# Altium schematic sheet STSPIN220 Stepper Motor Driver.SchDoc: Stepper Motor Driver
size A4
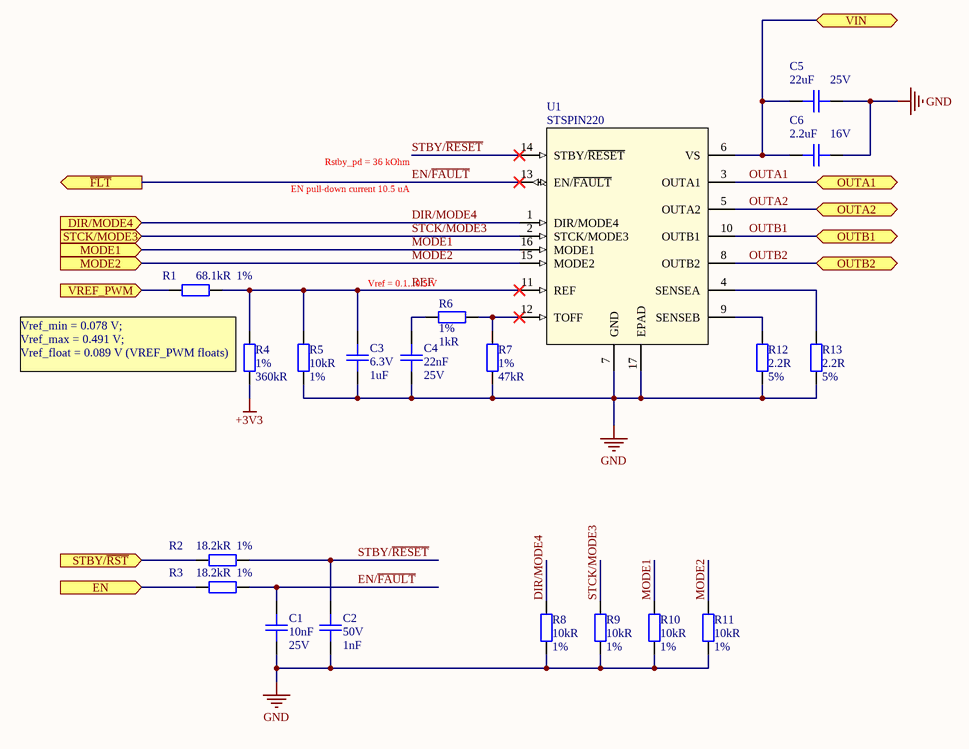
[diagram p0: STSPIN220 Stepper Motor Driver.SchDoc]

## Parts
C1  Capacitance: 10nF  Voltage: 25V  [C0402]  (hidden comment: CAP CER 10nF 25V X7R 10% 0402)
C2  Voltage Rating (DC): 50V  Capacitance: 1nF  [C0402]  (hidden comment: CAP CER 1000PF 50V X7R 0402)
C3  Voltage Rating: 6.3V  Capacitance: 1uF  [C0402]  (hidden comment: CAP CER 1UF 6.3V X5R 0402)
C4  Capacitance: 22nF  Voltage Rating: 25V  [C0402]  (hidden comment: CAP CER 0.022UF 25V X7R 0402)
C5  Capacitance: 22uF  Voltage Rating: 25V  [C0805]  (hidden comment: CAP CER 22UF 25V X5R 0805)
C6  Voltage Rating: 16V  Capacitance: 2.2uF  [C0603]  (hidden comment: CAP CER 2.2UF 16V X5R 0603)
R1  Resistance: 68.1kR  Tolerance: 1%  [R0402]  (hidden comment: RES SMD 68.1K OHM 1% 1/16W 0402)
R2  Resistance: 18.2kR  Tolerance: 1%  [R0402]  (hidden comment: RES SMD 18.2K OHM 1% 1/16W 0402)
R3  Resistance: 18.2kR  Tolerance: 1%  [R0402]  (hidden comment: RES SMD 18.2K OHM 1% 1/16W 0402)
R4  Tolerance: 1%  Resistance: 360kR  [R0402]  (hidden comment: RES SMD 360KOHM 1% 1/16W 0402)
R5  Resistance: 10kR  Tolerance: 1%  [R0402]  (hidden comment: RES SMD 10K OHM 1% 1/16W 0402)
R6  Tolerance: 1%  Resistance: 1kR  [R0402]  (hidden comment: RES SMD 1K OHM 1% 1/16W 0402)
R7  Tolerance: 1%  Resistance: 47kR  [R0402]  (hidden comment: RES SMD 47K OHM 1% 1/16W 0402)
R8  Resistance: 10kR  Tolerance: 1%  [R0402]  (hidden comment: RES SMD 10K OHM 1% 1/16W 0402)
R9  Resistance: 10kR  Tolerance: 1%  [R0402]  (hidden comment: RES SMD 10K OHM 1% 1/16W 0402)
R10  Resistance: 10kR  Tolerance: 1%  [R0402]  (hidden comment: RES SMD 10K OHM 1% 1/16W 0402)
R11  Resistance: 10kR  Tolerance: 1%  [R0402]  (hidden comment: RES SMD 10K OHM 1% 1/16W 0402)
R12  Resistance: 2.2R  Tolerance: 5%  [R2512]  (hidden comment: RES SMD 2.2 OHM 5% 1W 2512)
R13  Resistance: 2.2R  Tolerance: 5%  [R2512]  (hidden comment: RES SMD 2.2 OHM 5% 1W 2512)
U1  STSPIN220  [VFQFPN-16_STM]

## Ports
DIR/MODE4 (in), EN (in), MODE1 (in), MODE2 (in), OUTA1, OUTA2, OUTB1, OUTB2, STBY/~{RST} (in), STCK/MODE3 (in), VIN, VREF_PWM (in), ~{FLT} (out)

## Nets
+3V3: R4.2
GND: C1.1 C2.1 C3.1 C4.1 C5.2 C6.2 R5.1 R7.1 R8.1 R9.1 R10.1 R11.1 R12.1 R13.1 U1.7(GND) U1.17(EPAD)
DIR/MODE4: R8.2 U1.1(DIR/MODE4) ; port DIR/MODE4
EN: R3.2 ; port EN
EN/~{FAULT}: C1.2 R3.1 U1.13(EN/~{FAULT}) ; port ~{FLT}
MODE1: R10.2 U1.16(MODE1) ; port MODE1
MODE2: R11.2 U1.15(MODE2) ; port MODE2
OUTA1: U1.3(OUTA1) ; port OUTA1
OUTA2: U1.5(OUTA2) ; port OUTA2
OUTB1: U1.10(OUTB1) ; port OUTB1
OUTB2: U1.8(OUTB2) ; port OUTB2
REF: C3.2 R1.1 R4.1 R5.2 U1.11(REF)
STBY/~{RESET}: C2.2 R2.1 U1.14(STBY/~{RESET})
STBY/~{RST}: R2.2 ; port STBY/~{RST}
STCK/MODE3: R9.2 U1.2(STCK/MODE3) ; port STCK/MODE3
VIN: C5.1 C6.1 U1.6(VS) ; port VIN
VREF_PWM: R1.2 ; port VREF_PWM
NetC4_2: C4.2 R6.1
NetR6_2: R6.2 R7.2 U1.12(TOFF)
NetR12_2: R12.2 U1.9(SENSEB)
NetR13_2: R13.2 U1.4(SENSEA)

## Notes on the sheet
- (near U1) Rstby_pd = 36 kOhm
- (near U1) EN pull-down current 10.5 uA
- Vref = 0.1...0.5 V
- (near R4) Vref_min = 0.078 V;
  Vref_max = 0.491 V;
  Vref_float = 0.089 V (VREF_PWM floats)
- Title
- Size:
- Date:
- A4
- Number:
- Time:
- Revision:
- Sheet
- of
- File:

## Library data of the parts
C1 = CAP CER 10nF 25V X7R 10% 0402: Manufacturer: Kyocera AVX; Manufacturer Part Number: 04023C103KAT2A; Dissipation Factor: 12.5%; Insulation Resistance: 100GR; Supplier 1: Digi-Key; Stock 1: 1015537; Pricing 1: 1=0.1, 10=0.034, 50=0.0182, 100=0.0149, 500=0.0107, 1000=0.0084, 2500=0.0076, 5000=0.007 (USD); Mount: Surface Mount; Case/Package: 0402; Case Code (Metric): 1005; Case Code (Imperial): 0402; Min Operating Temperature: -55°C; Max Operating Temperature: 125°C; Tolerance: 10%; Dielectric: X7R; Voltage Rating (DC): 25V; Packaging: Tape and Reel; Voltage Rating: 25V; Package Quantity: 1; Termination: SMD/SMT; Length: 1mm; Height: 0.56mm; Depth: 0.5mm; Width: 0.02inch; Thickness: 0.022inch; Radiation Hardening: No; REACH SVHC: No SVHC; Lead Free: Lead Free; ComponentLink1URL: http://www.farnell.com/datasheets/2237835.pdf?src-supplier=Element14; ComponentLink1Description: http://www.farnell.com/datasheets/2237835.pdf?src-supplier=Element14; ComponentLink2URL: http://catalogs.avx.com/SurfaceMount.pdf?src-supplier=Digi-Key; ComponentLink2Description: http://catalogs.avx.com/SurfaceMount.pdf?src-supplier=Digi-Key; ComponentLink3URL: http://www.alliedelec.com/m/d/a24bb5190bea413b2ff164816f55e87c.pdf?src-supplier=Allied+Electronics; ComponentLink3Description: http://www.alliedelec.com/m/d/a24bb5190bea413b2ff164816f55e87c.pdf?src-supplier=Allied+Electronics; ComponentLink4URL: http://uk.rs-online.com/webdocs/13ec/0900766b813ece35.pdf?src-supplier=RSComponents; ComponentLink4Description: http://uk.rs-online.com/webdocs/13ec/0900766b813ece35.pdf?src-supplier=RSComponents; Supplier Part Number 1: 478-1113-1-ND
C2 = CAP CER 1000PF 50V X7R 0402: 1000pF ±10% 50V Ceramic Capacitor X7R 0402 (1005 Metric); Manufacturer: TDK-Lambda; Manufacturer Part Number: C0402C102K5RACTU; Supplier 1: Digi-Key; Stock 1: 1578852; Pricing 1: 1=0.1, 10=0.021, 50=0.0116, 100=0.0095, 500=0.0068, 1000=0.0053, 2500=0.0048, 5000=0.0045 (USD); Case/Package: 0402; Number of Pins: 2; Dielectric Material: Ceramic; Dielectric: X7R; Packaging: Cut Tape; Tolerance: 10%; Length: 1mm; Height: 500um; Width: 500um; REACH SVHC: No SVHC; ComponentLink1URL: http://www.onlinecomponents.com/productFiles/mf-KEM/kem_c1002_x7r_smd.pdf?src-supplier=Onlinecomponents.com; ComponentLink1Description: http://www.onlinecomponents.com/productFiles/mf-KEM/kem_c1002_x7r_smd.pdf?src-supplier=Onlinecomponents.com; Supplier Part Number 1: 399-1032-6-ND; Mount: Surface Mount
C3 = CAP CER 1UF 6.3V X5R 0402: 1µF ±10% 6.3V Ceramic Capacitor X5R 0402 (1005 Metric); Manufacturer: Yageo; Manufacturer Part Number: CC0402KRX5R5BB105; Supplier 1: Digi-Key; Stock 1: 34926286; Pricing 1: 1=0.1, 10=0.05, 50=0.0272, 100=0.0222, 500=0.0158, 1000=0.0124, 2500=0.0113, 5000=0.0104 (USD); Mount: Surface Mount; Case/Package: 0402; Number of Pins: 2; Case Code (Imperial): 0402; Case Code (Metric): 1005; Dielectric Material: Ceramic; Min Operating Temperature: -55°C; Max Operating Temperature: 85°C; Tolerance: 10%; Packaging: Tape and Reel; Dielectric: X5R; Voltage Rating (DC): 6.3V; Package Quantity: 1; Termination: SMD/SMT; Length: 1mm; Height: 0.5mm; Width: 0.02inch; Thickness: 0.022inch; Depth: 0.5mm; Radiation Hardening: No; Lead Free: Lead Free; REACH SVHC: No SVHC; ComponentLink1URL: http://www.farnell.com/datasheets/70765.pdf?src-supplier=Farnell; ComponentLink1Description: http://www.farnell.com/datasheets/70765.pdf?src-supplier=Farnell; ComponentLink2URL: http://www.yageo.com/documents/recent/UPY-GPHC_X5R_4V-to-50V_25.pdf?src-supplier=Digi-Key; ComponentLink2Description: http://www.yageo.com/documents/recent/UPY-GPHC_X5R_4V-to-50V_25.pdf?src-supplier=Digi-Key; Supplier Part Number 1: 311-1438-1-ND; Composition: Ceramic; Halogen Free: Halogen Free; ComponentLink3URL: http://www.farnell.com/datasheets/2167237.pdf?src-supplier=Element14; ComponentLink3Description: http://www.farnell.com/datasheets/2167237.pdf?src-supplier=Element14; ComponentLink4URL: http://www.yageo.com/documents/recent/UPY-GPHC_X5R_4V-to-50V_12.pdf?src-supplier=Avnet+Europe; ComponentLink4Description: http://www.yageo.com/documents/recent/UPY-GPHC_X5R_4V-to-50V_12.pdf?src-supplier=Avnet+Europe; ComponentLink5URL: http://www.farnell.com/datasheets/1359354.pdf?src-supplier=Element14; ComponentLink5Description: http://www.farnell.com/datasheets/1359354.pdf?src-supplier=Element14; ComponentLink6URL: http://www.farnell.com/datasheets/70765.pdf?src-supplier=Element14; ComponentLink6Description: http://www.farnell.com/datasheets/70765.pdf?src-supplier=Element14; ComponentLink7URL: http://www.yageo.com/documents/recent/UPY-GPHC_X5R_4V-to-50V_12.pdf?src-supplier=Avnet; ComponentLink7Description: http://www.yageo.com/documents/recent/UPY-GPHC_X5R_4V-to-50V_12.pdf?src-supplier=Avnet
C4 = CAP CER 0.022UF 25V X7R 0402: 0.022µF ±10% 25V Ceramic Capacitor X7R 0402 (1005 Metric); Manufacturer: TDK; Manufacturer Part Number: CGA2B2X7R1E223K050BA; Supplier 1: Digi-Key; Stock 1: 330320; Pricing 1: 1=0.1, 10=0.057, 50=0.0312, 100=0.0255, 500=0.0182, 1000=0.0143, 2500=0.013, 5000=0.012 (USD); Mount: Surface Mount; Case/Package: 0402; Weight: 2.3E-05oz; Case Code (Imperial): 0402; Case Code (Metric): 1005; Min Operating Temperature: -55°C; Max Operating Temperature: 125°C; Voltage Rating (DC): 25V; Tolerance: 10%; Packaging: Tape and Reel; Package Quantity: 1; Dielectric: X7R; Termination: SMD/SMT; Composition: Ceramic; Length: 1mm; Height: 0.5mm; Width: 0.5mm; Thickness: 0.022inch; Depth: 0.5mm; Ratings: AEC-Q200; REACH SVHC: No SVHC; ComponentLink1URL: http://www.mouser.com/ds/2/400/lcc_automotive_general_en-843974.pdf?src-supplier=Mouser; ComponentLink1Description: http://www.mouser.com/ds/2/400/lcc_automotive_general_en-843974.pdf?src-supplier=Mouser; Supplier Part Number 1: 445-5609-1-ND
C5 = CAP CER 22UF 25V X5R 0805: 22µF ±20% 25V Ceramic Capacitor X5R 0805 (2012 Metric); Manufacturer: Yageo; Manufacturer Part Number: CC0805MKX5R8BB226; Supplier 1: Digi-Key; Stock 1: 1060; Pricing 1: 1=0.5, 10=0.353, 50=0.267, 100=0.2325, 500=0.1722, 1000=0.1464 (USD); Mount: Surface Mount; Case/Package: 0805; Weight: 0.000194oz; Case Code (Metric): 2012; Case Code (Imperial): 0805; Min Operating Temperature: -55°C; Max Operating Temperature: 85°C; Packaging: Tape and Reel; Tolerance: 20%; Dielectric: X5R; Termination: SMD/SMT; Voltage Rating (DC): 25V; Package Quantity: 3000; Length: 0.079inch; Height: 1.25mm; Width: 0.049inch; Thickness: 0.057inch; Lead Free: Lead Free; Halogen Free: Halogen Free; ComponentLink1URL: http://www.yageo.com/documents/recent/UPY-GPHC_X5R_4V-to-50V_25.pdf?src-supplier=Digi-Key; ComponentLink1Description: http://www.yageo.com/documents/recent/UPY-GPHC_X5R_4V-to-50V_25.pdf?src-supplier=Digi-Key; ComponentLink2URL: http://www.mouser.com/ds/2/447/Yageo_UPY-GP_NP0_16V-to-50V_9-358835.pdf?src-supplier=Mouser; ComponentLink2Description: http://www.mouser.com/ds/2/447/Yageo_UPY-GP_NP0_16V-to-50V_9-358835.pdf?src-supplier=Mouser; Supplier Part Number 1: 311-1903-1-ND
C6 = CAP CER 2.2UF 16V X5R 0603: 2.2µF ±10% 16V Ceramic Capacitor X5R 0603 (1608 Metric); Manufacturer: Yageo; Manufacturer Part Number: CC0603KRX5R7BB225; Supplier 1: Digi-Key; Stock 1: 126369; Pricing 1: 1=0.19, 10=0.132, 100=0.0667, 500=0.0456, 1000=0.0404 (USD); Mount: Surface Mount; Case/Package: 0603; Case Code (Imperial): 0603; Case Code (Metric): 1608; Min Operating Temperature: -55°C; Max Operating Temperature: 85°C; Tolerance: 10%; Packaging: Tape and Reel; Dielectric: X5R; Voltage Rating (DC): 16V; Termination: SMD/SMT; Length: 1.6mm; Height: 0.8mm; Width: 0.031inch; Thickness: 0.035inch; Depth: 0.8mm; Radiation Hardening: No; Lead Free: Lead Free; REACH SVHC: Unknown; ComponentLink1URL: http://www.farnell.com/datasheets/2167237.pdf?src-supplier=Element14; ComponentLink1Description: http://www.farnell.com/datasheets/2167237.pdf?src-supplier=Element14; Supplier Part Number 1: 311-1784-1-ND; Composition: Ceramic; Halogen Free: Halogen Free
R1 = RES SMD 68.1K OHM 1% 1/16W 0402: 68.1 kOhms ±1% 0.063W, 1/16W Chip Resistor 0402 (1005 Metric) Moisture Resistant Thick Film; Manufacturer: Yageo; Manufacturer Part Number: RC0402FR-0768K1L; Power Rating: 62.5mW; Voltage Rating: 50V; Temperature Coefficient: 100ppm/°C; Max Power Dissipation: 63mW; Supplier 1: Digi-Key; Stock 1: 140424; Pricing 1: 1=0.1, 10=0.016, 100=0.0064, 1000=0.0029, 2500=0.0025, 5000=0.0021 (USD); Case/Package: 0402; Weight: 2.3E-05oz; Case Code (Imperial): 0402; Case Code (Metric): 1005; Min Operating Temperature: -55°C; Max Operating Temperature: 155°C; Packaging: Tape and Reel; Composition: Thick Film; Number of Terminations: 2; Termination: SMD/SMT; Military Standard: Not; Voltage Rating (DC): 50V; Working Voltage: 50V; Features: Moisture Resistant; Length: 1mm; Height: 0.016inch; Width: 0.02inch; Depth: 0.5mm; Lead Free: Lead Free; ComponentLink1URL: http://www.mouser.com/ds/2/447/PYu-RC0402_51_RoHS_L_6_r-8721.pdf?src-supplier=Mouser; ComponentLink1Description: http://www.mouser.com/ds/2/447/PYu-RC0402_51_RoHS_L_6_r-8721.pdf?src-supplier=Mouser; ComponentLink2URL: http://www.yageo.com/documents/recent/PYu-RC0402_51_RoHS_L_6_r.pdf?src-supplier=Future+Electronics; ComponentLink2Description: http://www.yageo.com/documents/recent/PYu-RC0402_51_RoHS_L_6_r.pdf?src-supplier=Future+Electronics; ComponentLink3URL: https://www.verical.com/server-webapp/html/getDatasheet?partID=325048&src-supplier=Verical; ComponentLink3Description: https://www.verical.com/server-webapp/html/getDatasheet?partID=325048&src-supplier=Verical; Supplier Part Number 1: YAG3213CT-ND; Mount: Surface Mount
R2 R3 = RES SMD 18.2K OHM 1% 1/16W 0402: 18.2 kOhms ±1% 0.063W, 1/16W Chip Resistor 0402 (1005 Metric) Moisture Resistant Thick Film; Manufacturer: Yageo; Manufacturer Part Number: RC0402FR-0718K2L; Power Rating: 62.5mW; Voltage Rating: 50V; Temperature Coefficient: 100ppm/°C; Max Power Dissipation: 63mW; Supplier 1: Digi-Key; Stock 1: 372233; Pricing 1: 1=0.1, 10=0.015, 100=0.0062, 1000=0.0028, 2500=0.0024, 5000=0.002 (USD); Case/Package: 0402; Case Code (Metric): 1005; Case Code (Imperial): 0402; Contact Plating: Tin,Lead,Matte; Min Operating Temperature: -55°C; Max Operating Temperature: 155°C; Packaging: Tape and Reel; Package Quantity: 10000; Composition: Thick Film; Number of Terminations: 2; Termination: SMD/SMT; Military Standard: Not; Voltage Rating (DC): 50V; Working Voltage: 50V; Features: Moisture Resistant; Length: 1mm; Height: 0.016inch; Width: 0.02inch; Depth: 0.5mm; Radiation Hardening: No; Lead Free: Lead Free; ComponentLink1URL: http://www.yageo.com/documents/recent/PYu-RC0402_51_RoHS_L_6_r.pdf?src-supplier=Future+Electronics; ComponentLink1Description: http://www.yageo.com/documents/recent/PYu-RC0402_51_RoHS_L_6_r.pdf?src-supplier=Future+Electronics; ComponentLink2URL: http://www.yageo.com.tw/exep/pages/download/literatures/PYu-R_INT-thick_7.pdf?src-supplier=Digi-Key; ComponentLink2Description: http://www.yageo.com.tw/exep/pages/download/literatures/PYu-R_INT-thick_7.pdf?src-supplier=Digi-Key; ComponentLink3URL: http://www.mouser.com/ds/2/447/PYu-RC0402_51_RoHS_L_6_r-8721.pdf?src-supplier=Mouser; ComponentLink3Description: http://www.mouser.com/ds/2/447/PYu-RC0402_51_RoHS_L_6_r-8721.pdf?src-supplier=Mouser; ComponentLink4URL: http://www.yageo.com/documents/recent/PYu-RC0402_51_RoHS_L_6.pdf?src-supplier=Avnet+Europe; ComponentLink4Description: http://www.yageo.com/documents/recent/PYu-RC0402_51_RoHS_L_6.pdf?src-supplier=Avnet+Europe; Supplier Part Number 1: YAG2371CT-ND; Mount: Surface Mount
R4 = RES SMD 360KOHM 1% 1/16W 0402: 360 kOhms ±1% 0.063W, 1/16W Chip Resistor 0402 (1005 Metric) Moisture Resistant Thick Film; Manufacturer: Yageo; Manufacturer Part Number: RC0402FR-07360KL; Power Rating: 62.5mW; Voltage Rating: 50V; Temperature Coefficient: 100ppm/°C; Max Power Dissipation: 63mW; Supplier 1: Digi-Key; Stock 1: 472644; Pricing 1: 1=0.1, 10=0.016, 100=0.0064, 1000=0.0029, 2500=0.0025, 5000=0.0021 (USD); Case/Package: 0402; Case Code (Metric): 1005; Case Code (Imperial): 0402; Contact Plating: Tin,Matte; Min Operating Temperature: -55°C; Max Operating Temperature: 155°C; Packaging: Tape and Reel; Composition: Thick Film; Number of Terminations: 2; Termination: SMD/SMT; Military Standard: Not; Voltage Rating (DC): 50V; Package Quantity: 1; Features: Moisture Resistant; Length: 1mm; Height: 0.016inch; Width: 0.02inch; Depth: 0.5mm; REACH SVHC: Unknown; Lead Free: Lead Free; ComponentLink1URL: http://www.yageo.com/documents/recent/PYu-RC_Group_51_RoHS_L_10.pdf?src-supplier=Digi-Key; ComponentLink1Description: http://www.yageo.com/documents/recent/PYu-RC_Group_51_RoHS_L_10.pdf?src-supplier=Digi-Key; ComponentLink2URL: http://www.yageo.com/documents/recent/PYu-RC0402_51_RoHS_L_6_r.pdf?src-supplier=Future+Electronics; ComponentLink2Description: http://www.yageo.com/documents/recent/PYu-RC0402_51_RoHS_L_6_r.pdf?src-supplier=Future+Electronics; ComponentLink3URL: http://www.yageo.com/documents/recent/PYu-RC0402_51_RoHS_L_6.pdf?src-supplier=Avnet; ComponentLink3Description: http://www.yageo.com/documents/recent/PYu-RC0402_51_RoHS_L_6.pdf?src-supplier=Avnet; ComponentLink4URL: http://www.mouser.com/ds/2/447/PYu-RC0402_51_RoHS_L_6_r-8721.pdf?src-supplier=Mouser; ComponentLink4Description: http://www.mouser.com/ds/2/447/PYu-RC0402_51_RoHS_L_6_r-8721.pdf?src-supplier=Mouser; Supplier Part Number 1: 311-360KLRCT-ND; Mount: Surface Mount
R5 R8-R11 = RES SMD 10K OHM 1% 1/16W 0402: 10 kOhms ±1% 0.063W, 1/16W Chip Resistor 0402 (1005 Metric) Moisture Resistant Thick Film; Manufacturer: Yageo; Manufacturer Part Number: RC0402FR-0710KP; Temperature Coefficient: 150ppm/°C; Max Power Dissipation: 63mW; Supplier 1: Digi-Key; Stock 1: 839368; Pricing 1: 1=0.1, 10=0.035, 100=0.014, 1000=0.0063, 2500=0.0055, 5000=0.0045 (USD); Case/Package: 0402; Case Code (Metric): 1005; Case Code (Imperial): 0402; Min Operating Temperature: -55°C; Max Operating Temperature: 155°C; Packaging: Tape and Reel; Composition: Thick Film; Number of Terminations: 2; Features: Moisture Resistant; Length: 0.039inch; Height: 0.016inch; Width: 0.02inch; ComponentLink1URL: http://www.yageo.com/NewPortal/yageodocoutput?fileName=/pdf/R-Chip/PYu-RC_51_RoHS_P_0.pdf&src-supplier=Digi-Key; ComponentLink1Description: http://www.yageo.com/NewPortal/yageodocoutput?fileName=/pdf/R-Chip/PYu-RC_51_RoHS_P_0.pdf&src-supplier=Digi-Key; Supplier Part Number 1: YAG1249CT-ND; Mount: Surface Mount
R6 = RES SMD 1K OHM 1% 1/16W 0402: 1 kOhms ±1% 0.063W, 1/16W Chip Resistor 0402 (1005 Metric) Moisture Resistant Thick Film; Manufacturer: Yageo; Manufacturer Part Number: RC0402FR-071KL; Temperature Coefficient: 100ppm/°C; Power Rating: 62.5mW; Voltage Rating: 50V; Supplier 1: Digi-Key; Stock 1: 9574509; Pricing 1: 1=0.1, 10=0.015, 100=0.0062, 1000=0.0028, 2500=0.0024, 5000=0.002 (USD); Case/Package: 0402; Number of Pins: 2; Case Code (Imperial): 0402; Case Code (Metric): 1005; Min Operating Temperature: -55°C; Max Operating Temperature: 155°C; Packaging: Tape and Reel; Composition: Thick Film; Voltage Rating (DC): 50V; Termination: SMD/SMT; Military Standard: Not; Length: 1mm; Height: 0.32mm; Width: 0.5mm; Depth: 0.5mm; REACH SVHC: Unknown; Lead Free: Lead Free; ComponentLink1URL: http://www.mouser.com/ds/2/447/PYu-RC0402_51_RoHS_L_6_r-8721.pdf?src-supplier=Mouser; ComponentLink1Description: http://www.mouser.com/ds/2/447/PYu-RC0402_51_RoHS_L_6_r-8721.pdf?src-supplier=Mouser; ComponentLink2URL: http://documents.rs-components.com/techlib://itc_doclist_GB.htm?stockno=6186122&src-supplier=RSComponents; ComponentLink2Description: http://documents.rs-components.com/techlib://itc_doclist_GB.htm?stockno=6186122&src-supplier=RSComponents; ComponentLink3URL: http://www.farnell.com/datasheets/1018594.pdf?src-supplier=Element14; ComponentLink3Description: http://www.farnell.com/datasheets/1018594.pdf?src-supplier=Element14; ComponentLink4URL: http://www.yageo.com/documents/recent/PYu-RC0402_51_RoHS_L_6_r.pdf?src-supplier=Future+Electronics; ComponentLink4Description: http://www.yageo.com/documents/recent/PYu-RC0402_51_RoHS_L_6_r.pdf?src-supplier=Future+Electronics; ComponentLink5URL: http://www.farnell.com/datasheets/2167052.pdf?src-supplier=Element14; ComponentLink5Description: http://www.farnell.com/datasheets/2167052.pdf?src-supplier=Element14; Supplier Part Number 1: 311-1.00KLRCT-ND; Mount: Surface Mount
R7 = RES SMD 47K OHM 1% 1/16W 0402: 47 kOhms ±1% 0.063W, 1/16W Chip Resistor 0402 (1005 Metric) Moisture Resistant Thick Film; Manufacturer: Yageo; Manufacturer Part Number: RC0402FR-0747KL; Power Rating: 62.5mW; Voltage Rating: 50V; Temperature Coefficient: 100ppm/°C; Max Power Dissipation: 63mW; Supplier 1: Digi-Key; Stock 1: 0; Pricing 1: 1=0.1, 10=0.015, 100=0.0062, 1000=0.0028, 2500=0.0024, 5000=0.002 (USD); Case/Package: 0402; Case Code (Imperial): 0402; Case Code (Metric): 1005; Min Operating Temperature: -55°C; Max Operating Temperature: 155°C; Packaging: Tape and Reel; Package Quantity: 1; Termination: SMD/SMT; Composition: Thick Film; Number of Terminations: 2; Military Standard: Not; Features: Moisture Resistant; Length: 1mm; Height: 0.016inch; Width: 0.5mm; Depth: 0.5mm; REACH SVHC: Unknown; Lead Free: Lead Free; ComponentLink1URL: http://www.yageo.com/documents/recent/PYu-RC0402_51_RoHS_L_6_r.pdf?src-supplier=Future+Electronics; ComponentLink1Description: http://www.yageo.com/documents/recent/PYu-RC0402_51_RoHS_L_6_r.pdf?src-supplier=Future+Electronics; ComponentLink2URL: http://www.farnell.com/datasheets/1018594.pdf?src-supplier=Element14; ComponentLink2Description: http://www.farnell.com/datasheets/1018594.pdf?src-supplier=Element14; ComponentLink3URL: https://www.verical.com/server-webapp/html/getDatasheet?partID=323748&src-supplier=Verical; ComponentLink3Description: https://www.verical.com/server-webapp/html/getDatasheet?partID=323748&src-supplier=Verical; ComponentLink4URL: http://www.yageo.com/documents/recent/PYu-RC_Group_51_RoHS_L_10.pdf?src-supplier=Digi-Key; ComponentLink4Description: http://www.yageo.com/documents/recent/PYu-RC_Group_51_RoHS_L_10.pdf?src-supplier=Digi-Key; Supplier Part Number 1: 311-47.0KLRCT-ND; Mount: Surface Mount
R12 R13 = RES SMD 2.2 OHM 5% 1W 2512: 2.2 Ohms ±5% 1W Chip Resistor 2512 (6432 Metric) Automotive AEC-Q200 Thick Film; Manufacturer: Vishay Dale; Manufacturer Part Number: CRCW25122R20JNEG; Temperature Coefficient: 200ppm/°C; Voltage Rating: 500V; Supplier 1: Digi-Key; Stock 1: 19521; Pricing 1: 1=0.34, 10=0.292, 100=0.114, 1000=0.0477 (USD); Case/Package: 2512; Number of Pins: 2; Case Code (Metric): 6432; Case Code (Imperial): 2512; Contact Plating: Tin; Min Operating Temperature: -55°C; Max Operating Temperature: 155°C; Package Quantity: 2000; Power Rating: 1W; Packaging: Tape and Reel; Composition: Thick Film; Number of Terminations: 2; Termination: SMD/SMT; Military Standard: Not; Max Power Dissipation: 1W; Features: Automotive AEC-Q200; Length: 6.3mm; Height: 0.6mm; Width: 3.15mm; Depth: 3.15mm; Radiation Hardening: No; REACH SVHC: Unknown; Lead Free: Lead Free; ComponentLink1URL: http://www.vishay.com/docs/20035/dcrcwe3.pdf?src-supplier=Digi-Key; ComponentLink1Description: http://www.vishay.com/docs/20035/dcrcwe3.pdf?src-supplier=Digi-Key; Supplier Part Number 1: 541-2.2XCT-ND; Weight: 0.001429oz; Number of Terminals: 2; Voltage Rating (DC): 500V; Mount: Surface Mount
U1 = IC STSPIN220 MOTOR DRVR BIPOLAR 0-5V 16FPN: Bipolar Motor Driver Power MOSFET Step/Direction 16-VFQFPN (3x3); Manufacturer: STMicroelectronics; Logic Function: AND; Output Current: 1.3A; Supplier 1: Digi-Key; Manufacturer Part Number: STSPIN220; Stock 1: 3586; Pricing 1: 1=1.62, 10=1.458, 25=1.3752, 100=1.1, 250=0.9625, 500=0.935, 1000=0.7425 (USD); Mount: Surface Mount; Min Operating Temperature: -40°C; Max Operating Temperature: 150°C; Packaging: Cut Tape; ComponentLink1URL: http://www.st.com/content/ccc/resource/technical/document/datasheet/group3/42/7e/5c/90/70/ef/47/95/DM00291865/files/DM00291865.pdf/jcr:content/translations/en.DM00291865.pdf?src-supplier=Digi-Key; ComponentLink1Description: http://www.st.com/content/ccc/resource/technical/document/datasheet/group3/42/7e/5c/90/70/ef/47/95/DM00291865/files/DM00291865.pdf/jcr:content/translations/en.DM00291865.pdf?src-supplier=Digi-Key; ComponentLink2URL: http://www.farnell.com/datasheets/2815804.pdf?src-supplier=Newark; ComponentLink2Description: http://www.farnell.com/datasheets/2815804.pdf?src-supplier=Newark; ComponentLink3URL: http://www.farnell.com/datasheets/2815804.pdf?src-supplier=Farnell; ComponentLink3Description: http://www.farnell.com/datasheets/2815804.pdf?src-supplier=Farnell; Supplier Part Number 1: 497-16602-1-ND